# EAGLE design Breathalyzer Board (EAGLE 7.2.0)
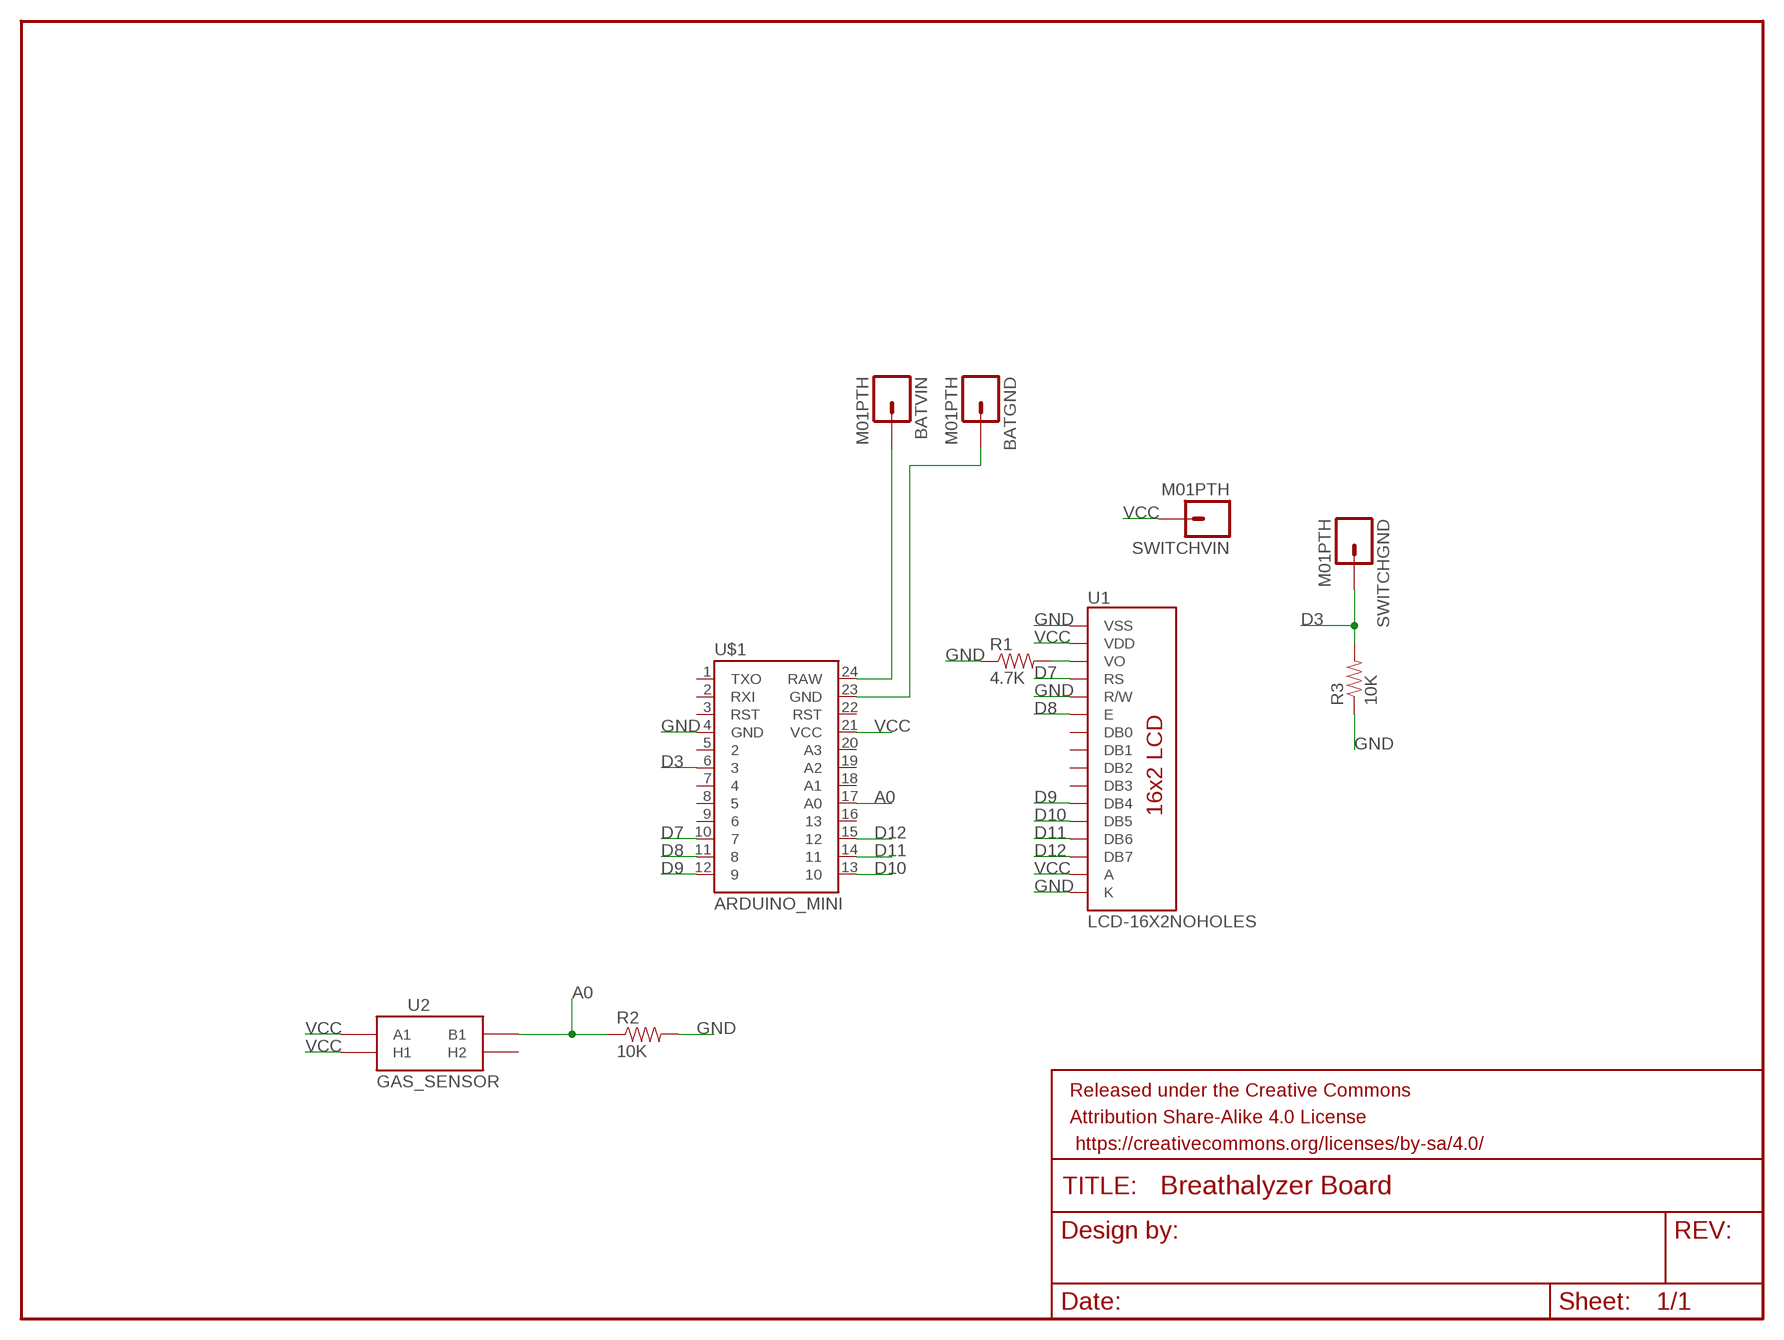
[diagram p0: schematic, sheet 1]

## Parts
BATGND  M01PTH  [1X01]
BATVIN  M01PTH  [1X01]
FRAME1  FRAME-LETTER  [CREATIVE_COMMONS]
R1  4.7K  RESISTORAXIAL-0.3  [AXIAL-0.3]
R2  10K  RESISTORAXIAL-0.3  [AXIAL-0.3]
R3  10K  RESISTORAXIAL-0.3  [AXIAL-0.3]
SWITCHGND  M01PTH  [1X01]
SWITCHVIN  M01PTH  [1X01]
U1  LCD-16X2NOHOLES  [LCD-16X2_NOHOLES]
U2  GAS_SENSOR  [MQ-3]
U$1  ARDUINO_MINI  [ARDUINO_MINI]

## Nets
A0: R2.P$1 U2.B1 U$1.17(A0)
D3: R3.P$2 SWITCHGND.1 U$1.6
D7: U1.4(RS) U$1.10
D8: U1.6(E) U$1.11
D9: U1.11(DB4) U$1.12
D10: U1.12(DB5) U$1.13
D11: U1.13(DB6) U$1.14
D12: U1.14(DB7) U$1.15
GND: R1.P$1 R2.P$2 R3.P$1 U1.1(VSS) U1.5(R/W) U1.16(K) U$1.4(GND)
N$1: BATVIN.1 U$1.24(RAW)
N$2: BATGND.1 U$1.23(GND)
N$4: R1.P$2 U1.3(VO)
VCC: SWITCHVIN.1 U1.2(VDD) U1.15(A) U2.A1 U2.HA(H1) U$1.21(VCC)
Unconnected: U1.7(DB0) U1.8(DB1) U1.9(DB2) U1.10(DB3) U2.HB(H2) U$1.1(TXO) U$1.2(RXI) U$1.3(RST) U$1.5 U$1.7 U$1.8 U$1.9 U$1.16 U$1.18(A1) U$1.19(A2) U$1.20(A3) U$1.22(RST)

## Library data of the parts
BATGND BATVIN SWITCHGND SWITCHVIN = SparkFun-Connectors:M01: Header 1 Standard 1-pin 0.1" header. Use with straight break away headers (SKU : PRT-00116), right angle break away headers (PRT-00553), swiss pins (PRT-00743), machine pins (PRT-00117), and female headers (PRT-00115).
FRAME1 = SparkFun-Aesthetics:FRAME-LETTER: Schematic Frame Standard 8.5x11 US Letter frame
R1 R2 = SparkFun-Resistors:RESISTOR: Resistor Basic schematic elements and footprints for 0603, 1206, and PTH resistors.
R3 = SparkFun-Passives:RESISTOR: Resistor Basic schematic elements and footprints for 0603, 1206, and PTH resistors.
U1 = SparkFun-Displays:LCD-16X2: Standard text-only 16x2 parallel input LCD
U2 = SparkFun-Sensors:GAS_SENSOR: MQ-3 alcohol gas sensor . FP not tested. SEN-08880.
U$1 = SparkFun-Boards:ARDUINO_MINI: Arduino Pro Mini footprint

## Board
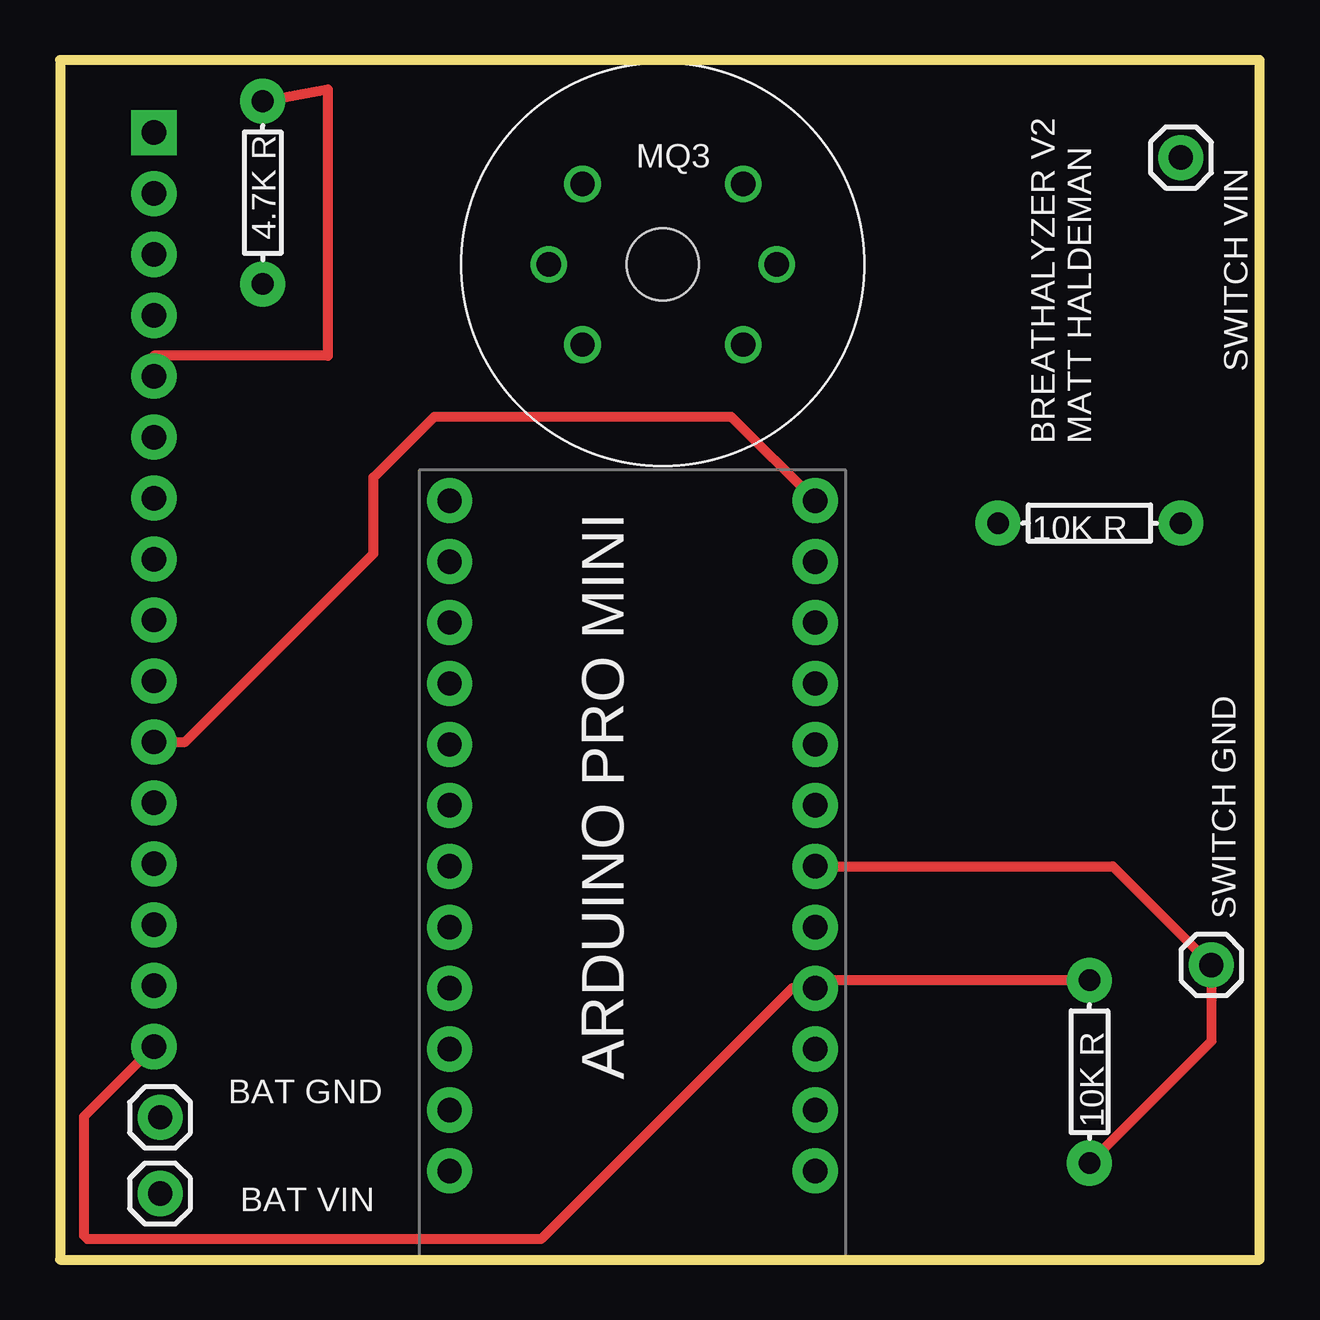
[diagram p1: board, top side]
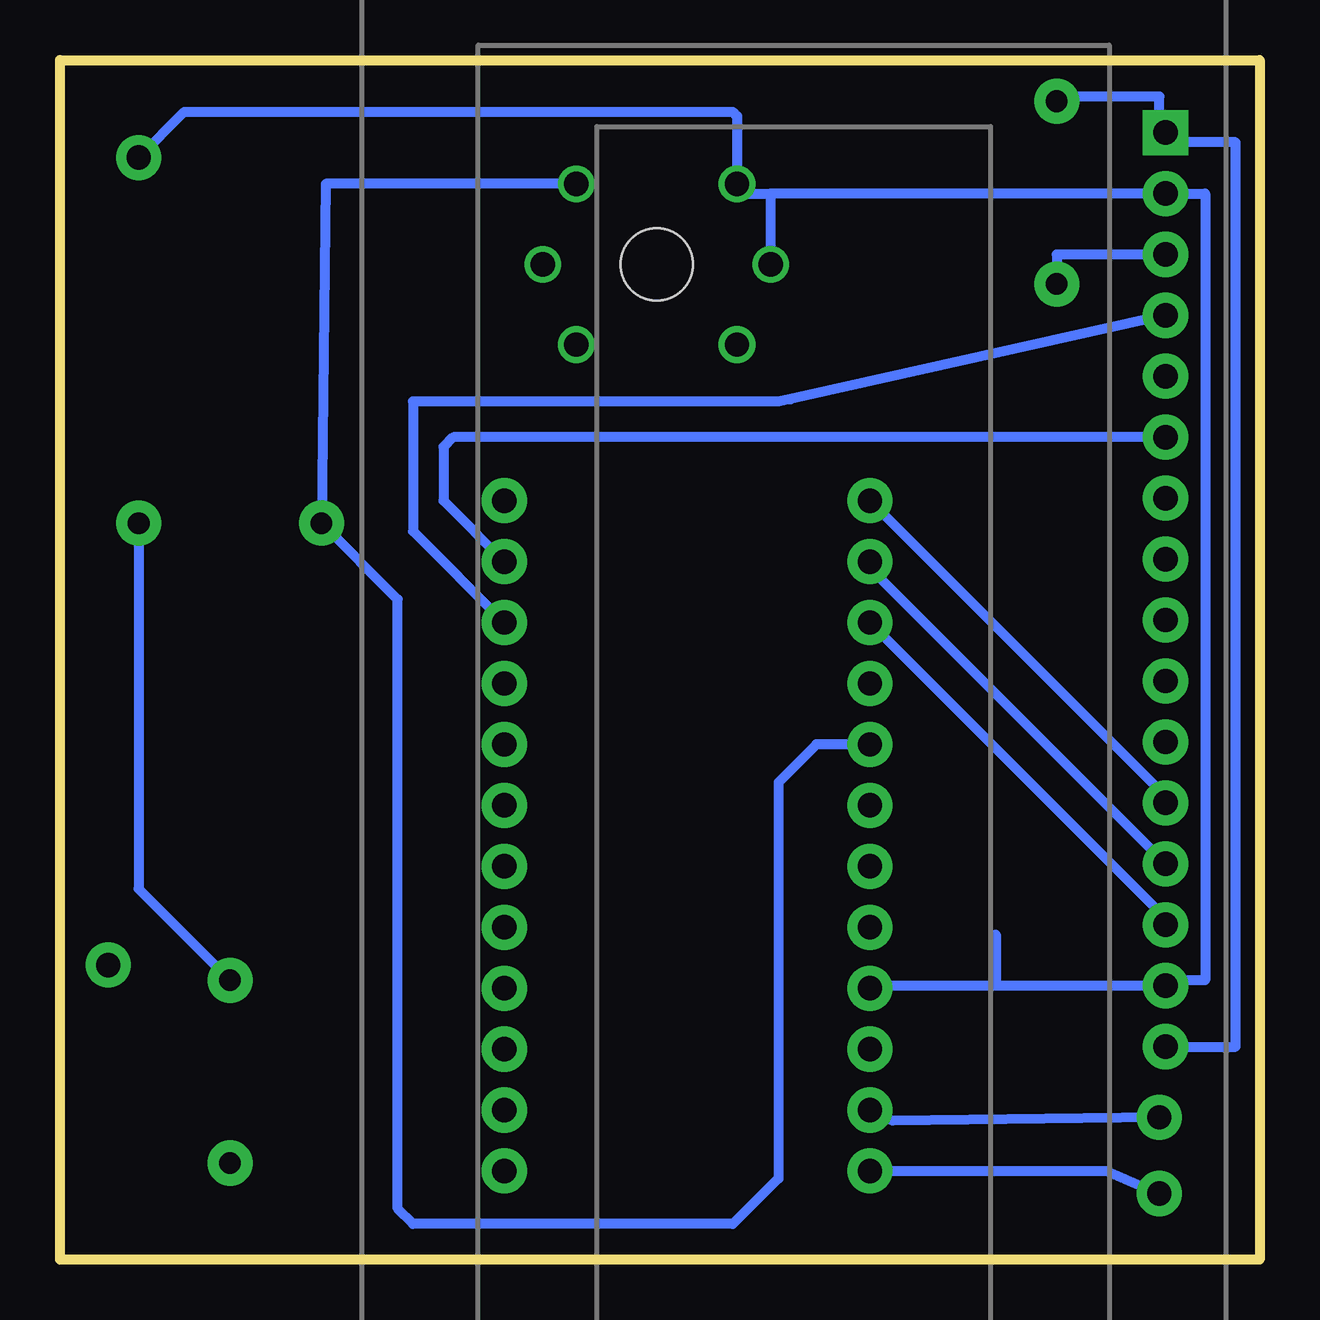
[diagram p2: board, bottom side, seen from below]

Size 50 x 50 mm. Coordinates in mm from the lower left corner, seen from the top.
Outline: 0,50 0,0 50,0 50,50 0,50
Copper layers (1*16): Top 0.035mm / dielectric 1.5mm / Bottom 0.035mm
Design rules "dirt_cheap_dirty_boards.v1": minimum track width 5mil, minimum drill 12mil, track to track 5mil, track to pad 5mil, pad to pad 5mil, via to via 5mil, smd to smd 0mil, copper to edge 10mil, drill to drill 10mil, minimum pad ring 10mil, minimum via ring 6mil, stop-mask expansion 2mil, vias tented up to drill 25mil, thermal gap 10mil

### Footprints (pad centres in the part's own frame; a part is rotated, then mirrored left to right if it is on the bottom)
1X01 = drill 1.016 pad 1.88: 1 0,0
AXIAL-0.3 = drill 0.9 pad 1.88: P$1 -3.81,0; P$2 3.81,0
LCD-16X2_NOHOLES = drill 1.016 pad 1.88 square: 1 -32,15.5 | drill 1.016 pad 1.88: 2 -29.46,15.5; 3 -26.92,15.5; 4 -24.38,15.5; 5 -21.84,15.5; 6 -19.3,15.5; 7 -16.76,15.5; 8 -14.22,15.5; 9 -11.68,15.5; 10 -9.14,15.5; 11 -6.6,15.5; 12 -4.06,15.5; 13 -1.52,15.5; 14 1.02,15.5; 15 3.56,15.5; 16 6.1,15.5
MQ-3 = drill 1.016: A1 -3.35,3.35; A2 -3.35,-3.35; B1 3.35,3.35; B2 3.35,-3.35; HA -4.75,0; HB 4.75,0 | hole 3: 0,0
ARDUINO_MINI = drill 1.016 pad 1.88: 1 -7.62,12.7; 2 -7.62,10.16; 3 -7.62,7.62; 4 -7.62,5.08; 5 -7.62,2.54; 6 -7.62,0; 7 -7.62,-2.54; 8 -7.62,-5.08; 9 -7.62,-7.62; 10 -7.62,-10.16; 11 -7.62,-12.7; 12 -7.62,-15.24; 13 7.62,-15.24; 14 7.62,-12.7; 15 7.62,-10.16; 16 7.62,-7.62; 17 7.62,-5.08; 18 7.62,-2.54; 19 7.62,0; 20 7.62,2.54; 21 7.62,5.08; 22 7.62,7.62; 23 7.62,10.16; 24 7.62,12.7

### Placement (x,y rotation side)
BATGND  4.17,5.92 0 top
BATVIN  4.17,2.75 0 top
FRAME1  -76.47,43.39 0 top  (outside the outline)
R1  8.45,44.47 270 top
R2  42.91,30.69 0 top
R3  42.91,7.83 270 top
SWITCHGND  47.99,12.27 0 top
SWITCHVIN  46.72,45.93 0 top
U1  19.41,14.98 270 bottom
U2  25.13,41.48 0 top
U$1  23.86,16.39 180 top

### Tracks (layer width: path | path; a pad name or v marks a point on that pad's centre or on a via)
A0
  Bottom 0.406: U2.B1 38.92,44.83 R2.P$1 35.92,27.52 35.92,2.11 35.29,1.48 21.95,1.48 20.05,3.38 20.05,19.9 18.48,21.47 U$1.17
D3
  Top 0.406: U$1.6 43.88,16.39 SWITCHGND.1 47.99,9.1 R3.P$2
D7
  Bottom 0.406: U1.4 19.55,35.86 20.05,35.77 35.29,35.77 35.29,30.36 U$1.10
D8
  Bottom 0.406: U1.6 33.61,34.27 34.02,33.87 34.02,31.63 U$1.11
D9
  Top 0.406: U1.11 5.22,21.58 13.06,29.42 13.06,32.59 15.61,35.14 27.98,35.14 U$1.12
D10
  Bottom 0.406: U1.12 3.92,19.3 U$1.13
D11
  Bottom 0.406: U$1.14 16.24,28.82 U1.13
D12
  Bottom 0.406: U1.14 3.92,14.23 U$1.15
GND
  Top 0.406: R1.P$1 11.16,48.78 11.16,37.67 3.92,37.67 U1.5 | R3.P$1 31.81,11.64 U$1.4 30.52,11.31 20.05,0.84 1.16,0.84 1,1 1,5.96 U1.16
  Bottom 0.406: U1.16 1,8.88 1,46.56 3.92,46.56 U1.1 4.17,46.97 4.17,48.47 8.45,48.47 R1.P$1 | R2.P$2 46.72,15.45 R3.P$1
N$1
  Bottom 0.406: U$1.24 6.38,3.69 BATVIN.1
N$2
  Bottom 0.406: BATGND.1 15.3,5.79 U$1.23
N$4
  Bottom 0.406: U1.3 8.45,41.89 R1.P$2
VCC
  Bottom 0.406: 11,11.41 U1.15 3.92,11.64 2.27,11.64 2.27,44.44 U1.2 20.38,44.44 | 11,11.41 16.24,11.41 U$1.21 | 11,13.55 11,11.41 | 20.38,44.44 21.78,44.44 U2.A1 21.78,47.66 21.95,47.83 44.81,47.83 SWITCHVIN.1 | 20.38,44.44 U2.HA

### Text on the board
tPlace: MQ3 | SWITCH VIN | 4.7K R | BREATHALYZER V2 / MATT HALDEMAN | 10K R | SWITCH GND | 10K R | BAT GND | ARDUINO PRO MINI | BAT VIN